# Altium schematic sheet Main.SchDoc
size A4
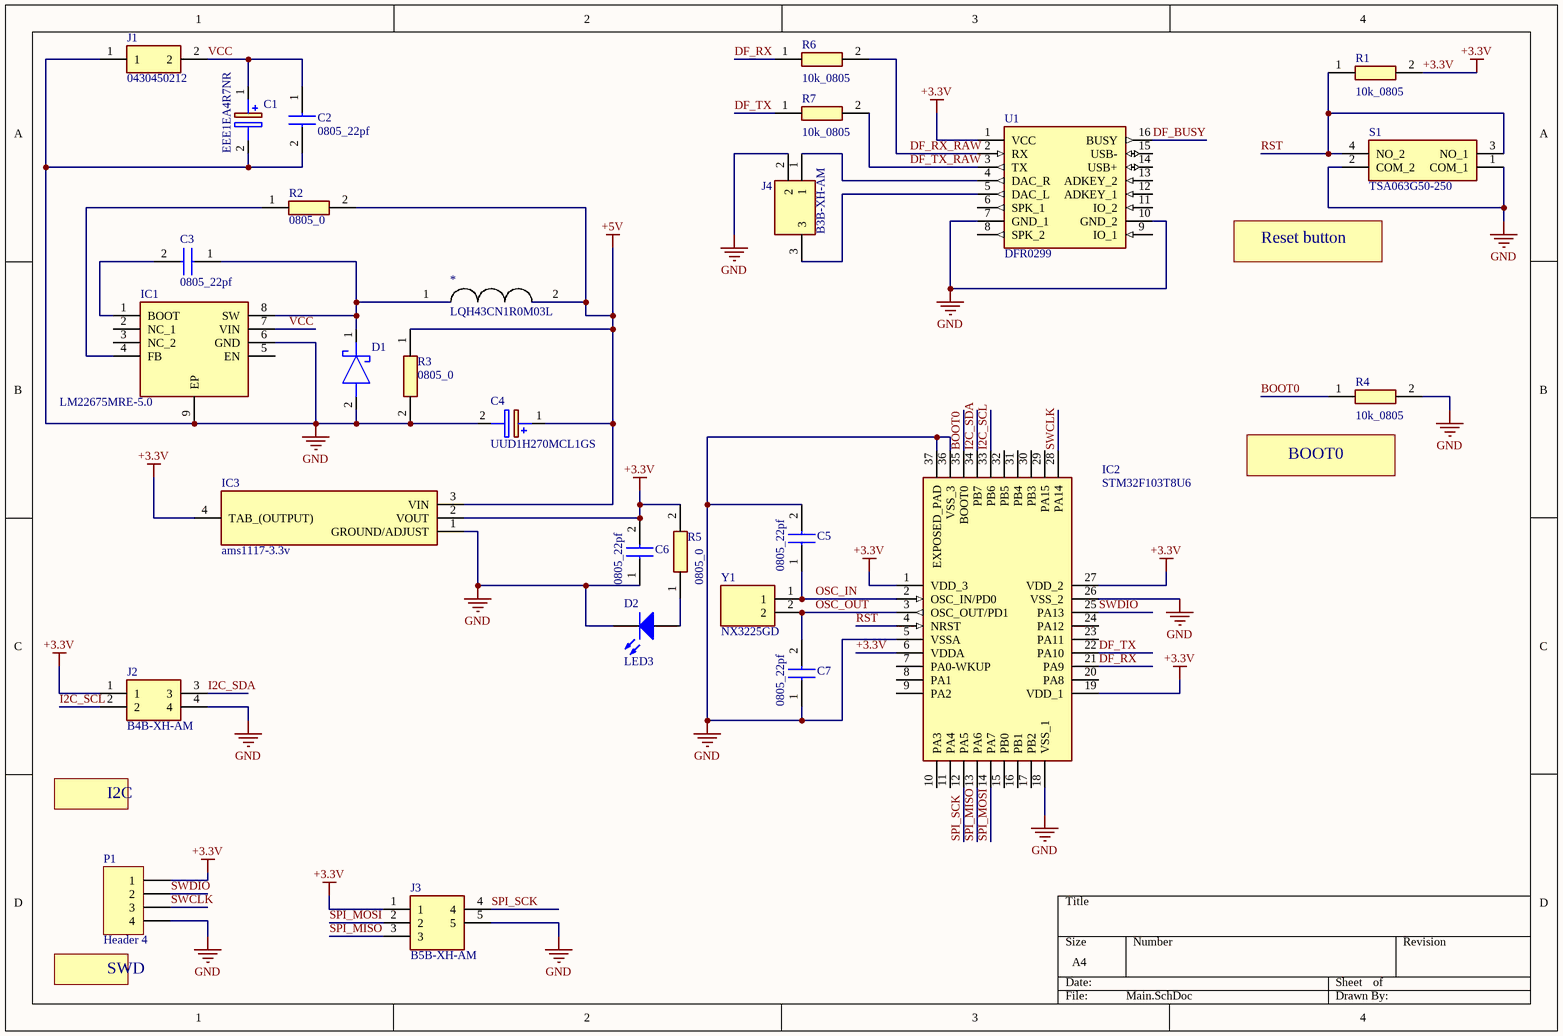
[diagram p0: Main.SchDoc]

## Parts
*  LQH43CN1R0M03L  [*IND_LQH43CN1R0M03L]
C1  EEE1EA4R7NR  [CAPAE530X550N]
C2  0805_22pf  [CAPC2012X94N]
C3  0805_22pf  [CAPC2012X94N]
C4  UUD1H270MCL1GS  [CAPAE660X820N]
C5  0805_22pf  [CAPC2012X94N]
C6  0805_22pf  [CAPC2012X94N]
C7  0805_22pf  [CAPC2012X94N]
D1  VS-30BQ015-M3_9AT  [DIOM7959X262N]  (value not drawn)
D2  LED3  [3.5X2.8X1.9]
IC1  LM22675MRE-5.0  [SOIC127P600X170-9N]
IC2  STM32F103T8U6  [Model Name]
IC3  ams1117-3.3v  [SOT229P700X180-4N]
J1  0430450212  [0430450212]
J2  B4B-XH-AM  [B4BXHAMLFSN]
J3  B5B-XH-AM  [B5BXHAMLFSN]
J4  B3B-XH-AM  [B3BXHAMLFSN]
P1  Header 4  [HDR1X4]
R1  10k_0805  [RESC2012X65N]
R2  0805_0  [RESC2012X65N]
R3  0805_0  [RESC2012X65N]
R4  10k_0805  [RESC2012X65N]
R5  0805_0  [RESC2012X65N]
R6  10k_0805  [RESC2012X65N]
R7  10k_0805  [RESC2012X65N]
S1  TSA063G50-250  [TSA063G50250]
U1  DFR0299  [DIPS1778W50P254L2100H170Q16N]
Y1  NX3225GD  [RESC3226X100N]

## Nets
+3.3V: C6.2 IC2.1(VDD_3) IC2.6(VDDA) IC2.19(VDD_1) IC2.27(VDD_2) IC3.2(VOUT) IC3.4(TAB_(OUTPUT)) J2.1 J3.1 P1.1 R1.2 R5.2 U1.1(VCC)
+5V: *.2 C4.1(+) IC3.3(VIN) R2.2 R3.1
GND: C1.2(-) C2.2 C4.2(-) C5.2 C6.1 C7.1 D1.2(A) D2.2(K) IC1.6(GND) IC1.9(EP) IC2.5(VSSA) IC2.18(VSS_1) IC2.26(VSS_2) IC2.36(VSS_3) IC2.37(EXPOSED_PAD) IC3.1(GROUND/ADJUST) J1.1 J2.4 J3.5 J4.2 P1.4 R3.2 R4.2 S1.1(COM_1) S1.2(COM_2) U1.7(GND_1) U1.10(GND_2)
BOOT0: IC2.35(BOOT0) R4.1
DF_BUSY: U1.16(BUSY)
DF_RX: IC2.21(PA9) R6.1
DF_RX_RAW: R6.2 U1.2(RX)
DF_TX: IC2.22(PA10) R7.1
DF_TX_RAW: R7.2 U1.3(TX)
I2C_SCL: IC2.33(PB6) J2.2
I2C_SDA: IC2.34(PB7) J2.3
OSC_IN: C5.1 IC2.2(OSC_IN/PD0) Y1.1
OSC_OUT: C7.2 IC2.3(OSC_OUT/PD1) Y1.2
RST: IC2.4(NRST) R1.1 S1.3(NO_1) S1.4(NO_2)
SPI_MISO: IC2.13(PA6) J3.3
SPI_MOSI: IC2.14(PA7) J3.2
SPI_SCK: IC2.12(PA5) J3.4
SWCLK: IC2.28(PA14) P1.3
SWDIO: IC2.25(PA13) P1.2
VCC: C1.1(+) C2.1 IC1.7(VIN) J1.2
Net*_1: *.1 C3.1 D1.1(K) IC1.8(SW)
NetC3_2: C3.2 IC1.1(BOOT)
NetD2_1: D2.1(A) R5.1
NetIC1_4: IC1.4(FB) R2.1
NetJ4_1: J4.1 U1.4(DAC_R)
NetJ4_3: J4.3 U1.5(DAC_L)

Not connected (* = marked no-connect by the designer): IC1 2(NC_1) 3(NC_2) 5(EN); IC2 7(PA0-WKUP) 8(PA1) 9(PA2) 10(PA3) 11(PA4) 15(PB0) 16(PB1) 17(PB2) 20(PA8) 23(PA11) 24(PA12) 29(PA15) 30(PB3) 31(PB4) 32(PB5); U1 6(SPK_1) 8(SPK_2) 9(IO_1) 11(IO_2) 12(ADKEY_1) 13(ADKEY_2) 14(USB+) 15(USB-)

## Notes on the sheet
- Reset button
- BOOT0
- I2C
- (near P1) SWD

## Library data of the parts
* = Component_1
C1 = EEE1EA4R7NR: Capacitor Polarised; Manufacturer_Name: Panasonic; Datasheet Link: https://datasheet.lcsc.com/szlcsc/1901071134_PANASONIC-EEE1EA4R7NR_C336510.pdf; Height: 5.5mm; Manufacturer_Part_Number: EEE1EA4R7NR
C2 C3 C5-C7 = 08055A101JAT2A: Capacitor; Manufacturer_Name: AVX; Allied_Number: 70474488; Datasheet Link: https://componentsearchengine.com/Datasheets/1/06031A100FAT2A.pdf; Height: 0.94mm; Manufacturer_Part_Number: 08055A101JAT2A; Mouser Part Number: 581-08055A101J; Mouser Price/Stock: https://www.mouser.com/Search/Refine.aspx?Keyword=581-08055A101J; RS Part Number: 0391000P; RS Price/Stock: http://uk.rs-online.com/web/p/products/0391000P; Allied Price/Stock: https://www.alliedelec.com/avx-08055a101jat2a/70474488/
C4 = UUD1H270MCL1GS: Capacitor Polarised; Manufacturer_Name: Nichicon; Datasheet Link: http://www.nichicon.co.jp/english/products/pdfs/e-uud.pdf; Height: 8.2mm; Manufacturer_Part_Number: UUD1H270MCL1GS; Mouser Part Number: 647-UUD1H270MCL; Mouser Price/Stock: https://www.mouser.com/Search/Refine.aspx?Keyword=647-UUD1H270MCL
D1 = VS-30BQ015-M3_9AT: Schottky Diode; Manufacturer_Name: Vishay; Manufacturer_Part_Number: VS-30BQ015-M3/9AT; Datasheet Link: https://www.vishay.com/docs/93359/vs-30bq015m.pdf; Height: 2.62mm; Mouser Part Number: 78-VS-30BQ015-M39AT; Mouser Price/Stock: https://www.mouser.com/Search/Refine.aspx?Keyword=78-VS-30BQ015-M39AT; RS Part Number: 5431623P; RS Price/Stock: http://uk.rs-online.com/web/p/products/5431623P
D2 = LED3: Typical BLUE SiC LED; Published: 8-Jun-2000; LatestRevisionDate: 17-Dec-2003; LatestRevisionNote: PCB Footprint replaced.; DatasheetVersion: 16-Apr-2002; PackageVersion: 16-Apr-2002; PackageReference: 3.5X2.8X1.9; Publisher: Altium Limited; PackageDescription: SM LED; 2 C-Bend Leads; Body 3.5 x 2.8 x 1.9 mm, inc leads (LxWxH typ)
IC1 = LM22675MRE-5.0_NOPB: Integrated Circuit; Manufacturer_Name: Texas Instruments; Manufacturer_Part_Number: LM22675MRE-5.0/NOPB; Datasheet Link: http://www.ti.com/lit/gpn/lm22675; Height: 1.7mm; Mouser Part Number: 926-LM22675MRE50NOPB; Mouser Price/Stock: https://www.mouser.com/Search/Refine.aspx?Keyword=926-LM22675MRE50NOPB; RS Part Number: 7615463P; RS Price/Stock: http://uk.rs-online.com/web/p/products/7615463P
IC2 = STM32F103T8U6: Integrated Circuit; Manufacturer_Name: STMicroelectronics; Allied_Number: 70391018; Datasheet Link: http://www.st.com/st-web-ui/static/active/en/resource/technical/document/datasheet/CD00161566.pdf; Height: 1mm; Manufacturer_Part_Number: STM32F103T8U6; Mouser Part Number: 511-STM32F103T8U6; Mouser Price/Stock: https://www.mouser.com/Search/Refine.aspx?Keyword=511-STM32F103T8U6; RS Part Number: 7249612P; RS Price/Stock: http://uk.rs-online.com/web/p/products/7249612P; Allied Price/Stock: http://www.alliedelec.com/stmicroelectronics-stm32f103t8u6/70391018/
IC3 = ams1117-3.3v: Integrated Circuit; Manufacturer_Name: Advanced Monolithic Systems; Datasheet Link: http://www.advanced-monolithic.com/pdf/ds1117.pdf; Height: 1.8mm; Manufacturer_Part_Number: ams1117-3.3v
J1 = 0430450212: Connector; Manufacturer_Name: Molex; Datasheet Link: http://www.molex.com/pdm_docs/sd/430450212_sd.pdf; Manufacturer_Part_Number: 0430450212
J2 = B4B-XH-AM_(LF)(SN): Connector; Manufacturer_Name: JST (JAPAN SOLDERLESS TERMINALS); Manufacturer_Part_Number: B4B-XH-AM (LF)(SN); Datasheet Link: http://www.jst-mfg.com/product/pdf/eng/eXH.pdf; Height: 7mm; RS Part Number: 1755445; RS Price/Stock: http://uk.rs-online.com/web/p/products/1755445
J3 = B5B-XH-AM_(LF)(SN): Connector; Manufacturer_Name: JST (JAPAN SOLDERLESS TERMINALS); Manufacturer_Part_Number: B5B-XH-AM (LF)(SN); Datasheet Link: http://uk.rs-online.com/web/p/products/1755317; Height: 7mm; RS Part Number: 1755489; RS Price/Stock: http://uk.rs-online.com/web/p/products/1755489
J4 = B3B-XH-AM(LF)(SN): Connector; Manufacturer_Name: JST (JAPAN SOLDERLESS TERMINALS); Datasheet Link: http://www.jst-mfg.com/product/pdf/eng/eXH.pdf; Height: 7mm; Manufacturer_Part_Number: B3B-XH-AM(LF)(SN)
P1 = Header 4: Header, 4-Pin; LatestRevisionDate: 17-Jul-2002; LatestRevisionNote: Re-released for DXP Platform.; Publisher: Altium Limited
R1-R7 = CPF0805B100KE: Resistor; Manufacturer_Name: TE Connectivity; Allied_Number: 70286772; Datasheet Link: http://docs-europe.electrocomponents.com/webdocs/13d1/0900766b813d116f.pdf; Height: 0.65mm; Manufacturer_Part_Number: CPF0805B100KE; Mouser Part Number: 279-CPF0805B100KE; Mouser Price/Stock: https://www.mouser.com/Search/Refine.aspx?Keyword=279-CPF0805B100KE; RS Part Number: 6662673; RS Price/Stock: https://uk.rs-online.com/web/p/products/6662673; Allied Price/Stock: https://www.alliedelec.com/te-connectivity-cpf0805b100ke/70286772/
S1 = TSA063G50-250: Switch; Manufacturer_Name: BRIGHT; Datasheet Link: https://datasheet.lcsc.com/szlcsc/BRIGHT-TSA063G50-250_C294565.pdf; Height: 5.2mm; Manufacturer_Part_Number: TSA063G50-250
U1 = DFR0299: Undefined or Miscellaneous; Manufacturer_Name: DFRobot; Datasheet Link: https://github.com/Arduinolibrary/DFPlayer_Mini_mp3/raw/master/DFPlayer%20Mini%20Manual.pdf; Height: 1.7mm; Manufacturer_Part_Number: DFR0299; Mouser Part Number: 426-DFR0299; Mouser Price/Stock: https://www.mouser.com/Search/Refine.aspx?Keyword=426-DFR0299
Y1 = NX3225GD-8MHZ-STD-CRA-3: Crystal or Oscillator; Manufacturer_Name: NDK; Datasheet Link: http://www.ndk.com/images/products/catalog/c_NX3225GD-STD-CRA-3_e.pdf; Height: 1mm; Manufacturer_Part_Number: NX3225GD-8MHZ-STD-CRA-3; Mouser Part Number: 344-NX3225GD8MCRA3; Mouser Price/Stock: https://www.mouser.com/Search/Refine.aspx?Keyword=344-NX3225GD8MCRA3; RS Part Number: 1847983; RS Price/Stock: http://uk.rs-online.com/web/p/products/1847983